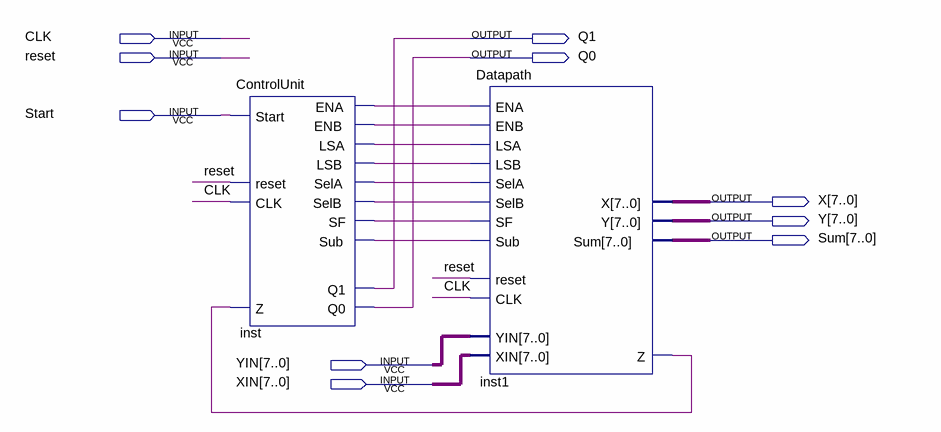
[diagram p0: schematic sheet]
// Quartus schematic Question1.bdf as structural Verilog: 2 symbols, 10 pins
module Question1 (
  input  CLK,
  input  reset,
  input  Start,
  input  [7:0] YIN,
  input  [7:0] XIN,
  output Q1,
  output Q0,
  output [7:0] X,
  output [7:0] Y,
  output [7:0] Sum
);

  wire inst1_z, inst_ena, inst_enb, inst_lsa, inst_lsb, inst_sela, inst_selb, inst_sf, inst_sub;

  ControlUnit inst (
    .Start(Start), .Z(inst1_z), .reset(reset), .CLK(CLK), .Q1(Q1), .Q0(Q0), .SF(inst_sf), .LSB(inst_lsb),
    .Sub(inst_sub), .LSA(inst_lsa), .SelB(inst_selb), .ENA(inst_ena), .ENB(inst_enb), .SelA(inst_sela));
  Datapath inst1 (
    .Sub(inst_sub), .CLK(CLK), .reset(reset), .ENA(inst_ena), .SF(inst_sf), .LSA(inst_lsa), .SelA(inst_sela),
    .XIN(XIN), .ENB(inst_enb), .LSB(inst_lsb), .SelB(inst_selb), .YIN(YIN), .Z(inst1_z), .X(X), .Sum(Sum),
    .Y(Y));
endmodule
